# EAGLE design 10+12-Bit RasPi-ADC_HAT v21 (EAGLE 8.2.2)
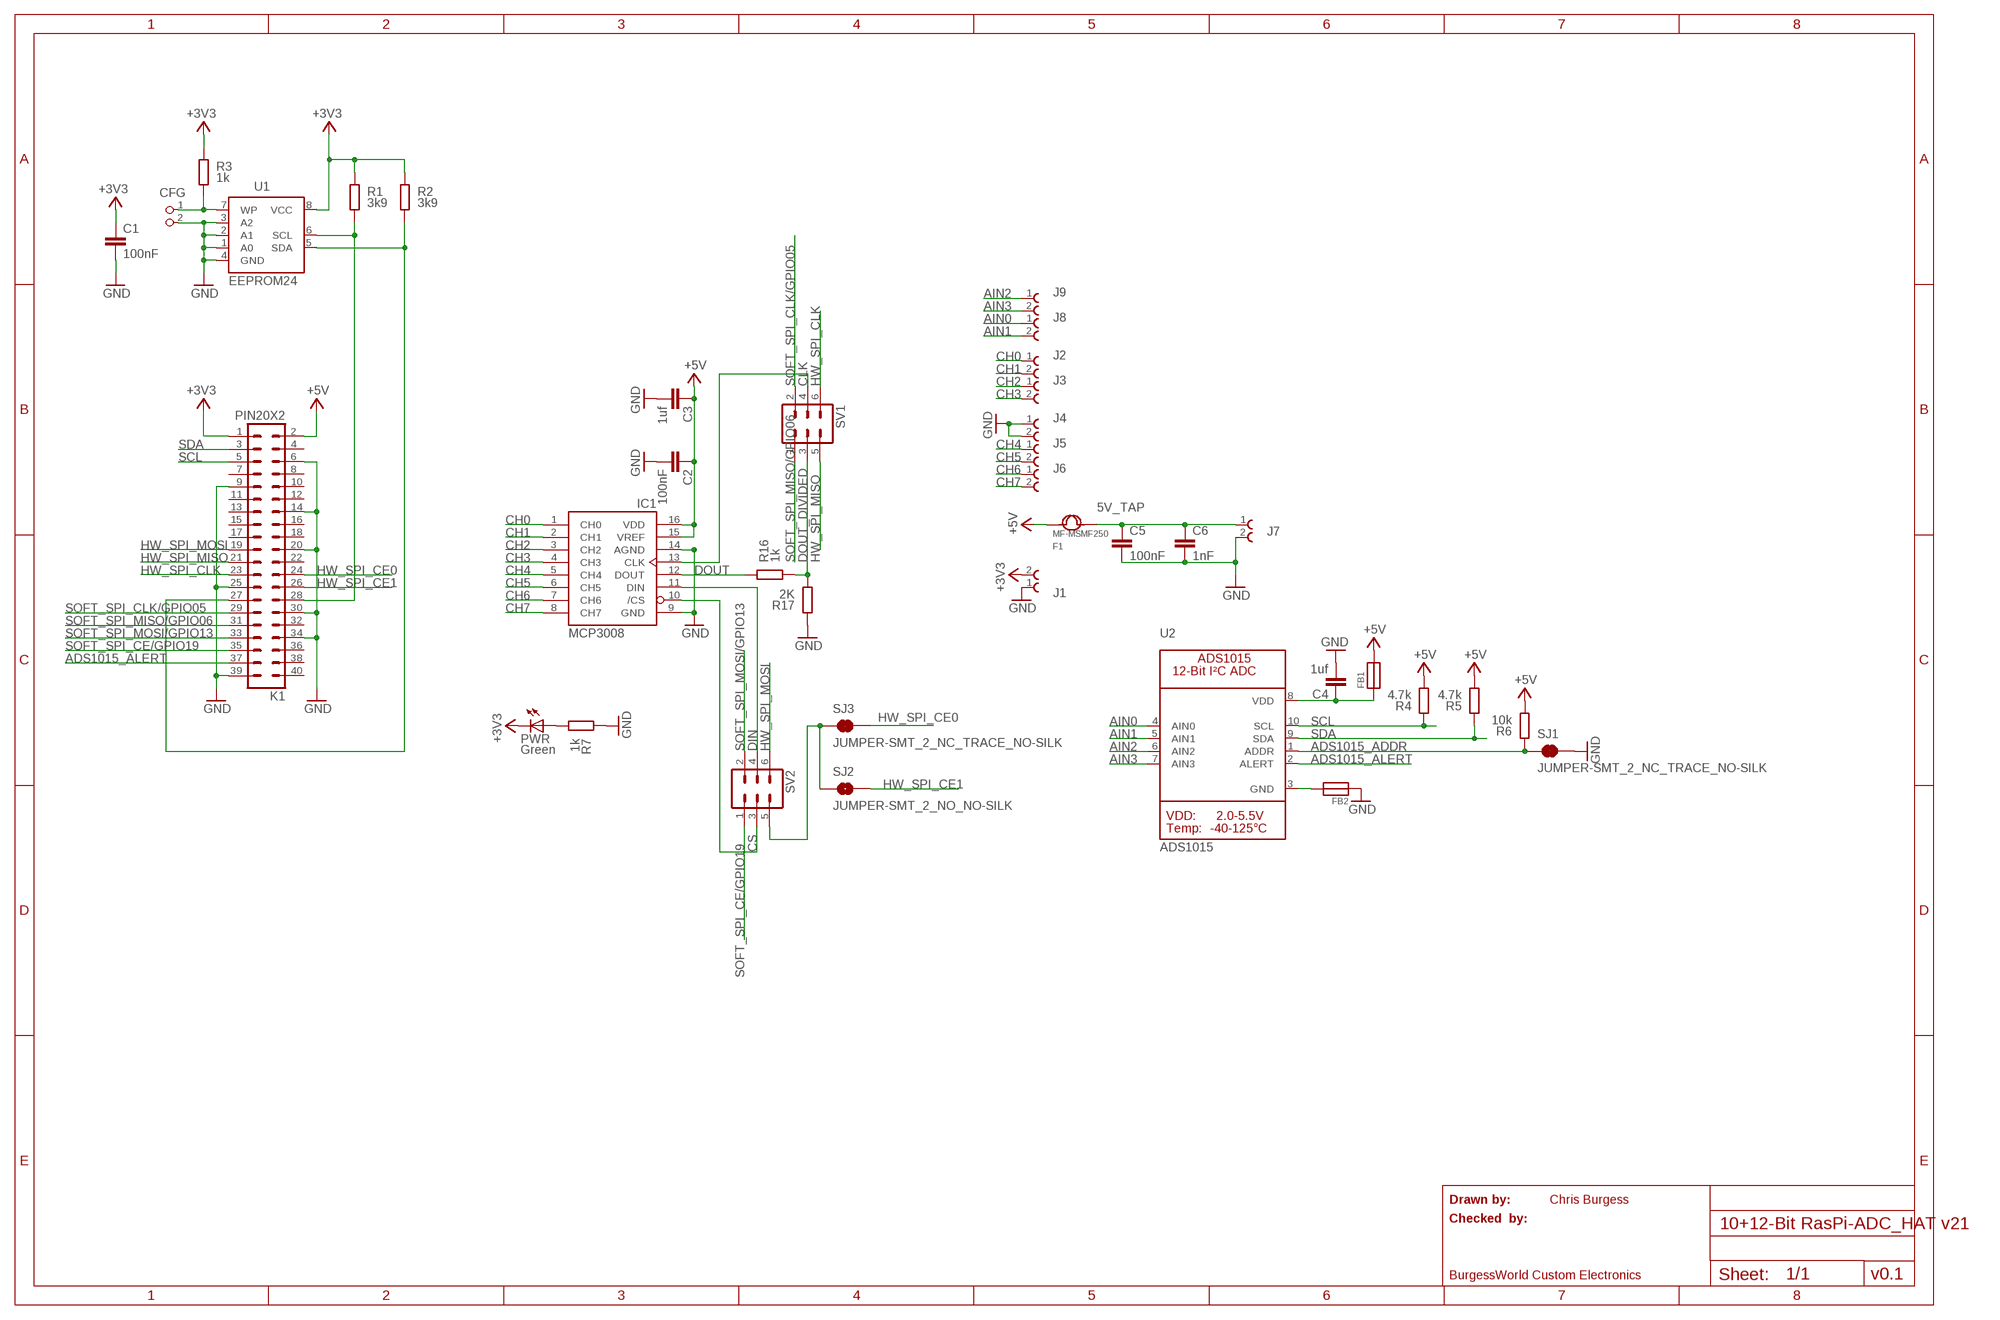
[diagram p0: schematic, sheet 1]

## Parts
C1  100nF  C-EUC0805K  [C0805K]
C2  100nF  C-EUC0805K  [C0805K]
C3  1uf  C-EUC0805K  [C0805K]
C4  1uf  C-EUC0805K  [C0805K]
C5  100nF  C-EUC0805K  [C0805K]
C6  1nF  C-EUC0805K  [C0805K]
CFG  PIN2_100  [PIN_W_2]
F1  MF-MSMF250  SMD-PPTC-USE-PPTC-0.50A-15V-0.15OHM(1812)  [F1812]
FB1  FERRITE0805  [0805]
FB2  FERRITE0805  [0805]
IC1  MCP3008  [DIL16]
J1  691214110002  [691214110002]
J2  691214110002  [691214110002]
J3  691214110002  [691214110002]
J4  691214110002  [691214110002]
J5  691214110002  [691214110002]
J6  691214110002  [691214110002]
J7  691214110002  [691214110002]
J8  691214110002  [691214110002]
J9  691214110002  [691214110002]
K1  PIN20X2  [PIN_20X2]
PWR  Green  LEDCHIPLED_0805  [CHIPLED_0805]
R1  3k9  R-EU_M0805  [M0805]
R2  3k9  R-EU_M0805  [M0805]
R3  1k  R-EU_M0805  [M0805]
R4  4.7k  R-EU_M0805  [M0805]
R5  4.7k  R-EU_M0805  [M0805]
R6  10k  R-EU_M0805  [M0805]
R7  1k  R-EU_M0805  [M0805]
R16  1k  R-EU_M0805  [M0805]
R17  2K  R-EU_M0805  [M0805]
SJ1  JUMPER-SMT_2_NC_TRACE_NO-SILK  [SMT-JUMPER_2_NC_TRACE_NO-SILK]
SJ2  JUMPER-SMT_2_NO_NO-SILK  [SMT-JUMPER_2_NO_NO-SILK]
SJ3  JUMPER-SMT_2_NC_TRACE_NO-SILK  [SMT-JUMPER_2_NC_TRACE_NO-SILK]
SV1  MA03-2  [MA03-2]
SV2  MA03-2  [MA03-2]
U1  EEPROM24  [SOIC8]
U2  ADS1015  ADC_ADS1015  [MSOP10]

## Nets
5V_TAP: C5.1 C6.1 F1.2 J7.1
+3V3: C1.1 J1.2 K1.1 PWR.C R1.2 R2.2 R3.2 U1.8(VCC)
+5V: C2.1 C3.1 F1.1 FB1.2 IC1.15(VREF) IC1.16(VDD) K1.2 R4.1 R5.1 R6.1
ADS1015_ADDR: R6.2 SJ1.1 U2.1(ADDR)
ADS1015_ALERT: K1.37 U2.2(ALERT)
ADS1015_FB: FB2.2 U2.3(GND)
ADS1015_VDD: C4.1 FB1.1 U2.8(VDD)
AIN0: J8.1 U2.4(AIN0)
AIN1: J8.2 U2.5(AIN1)
AIN2: J9.1 U2.6(AIN2)
AIN3: J9.2 U2.7(AIN3)
CH0: IC1.1(CH0) J2.1
CH1: IC1.2(CH1) J2.2
CH2: IC1.3(CH2) J3.1
CH3: IC1.4(CH3) J3.2
CH4: IC1.5(CH4) J5.1
CH5: IC1.6(CH5) J5.2
CH6: IC1.7(CH6) J6.1
CH7: IC1.8(CH7) J6.2
CLK: IC1.13(CLK) SV1.4
CS: IC1.10(/CS) SV2.3
DIN: IC1.11(DIN) SV2.4
DOUT: IC1.12(DOUT) R16.2
DOUT_DIVIDED: R16.1 R17.1 SV1.3
EEPROM_PROG: CFG.1 R3.1 U1.7(WP)
GND: C1.2 C2.2 C3.2 C4.2 C5.2 C6.2 CFG.2 FB2.1 IC1.9(GND) IC1.14(AGND) J1.1 J4.1 J4.2 J7.2 K1.6 K1.9 K1.14 K1.20 K1.25 K1.30 K1.34 K1.39 R7.2 R17.2 SJ1.2 U1.1(A0) U1.2(A1) U1.3(A2) U1.4(GND)
HW_SPI_CE: SJ2.1 SJ3.1 SV2.5
HW_SPI_CE0: K1.24 SJ3.2
HW_SPI_CE1: K1.26 SJ2.2
HW_SPI_CLK: K1.23 SV1.6
HW_SPI_MISO: K1.21 SV1.5
HW_SPI_MOSI: K1.19 SV2.6
ID_SC_27: K1.27 R2.1 U1.5(SDA)
ID_SC_28: K1.28 R1.1 U1.6(SCL)
N$1: PWR.A R7.1
SCL: K1.5 R4.2 U2.10(SCL)
SDA: K1.3 R5.2 U2.9(SDA)
SOFT_SPI_CE/GPIO19: K1.35 SV2.1
SOFT_SPI_CLK/GPIO05: K1.29 SV1.2
SOFT_SPI_MISO/GPIO06: K1.31 SV1.1
SOFT_SPI_MOSI/GPIO13: K1.33 SV2.2
Unconnected: K1.4 K1.7 K1.8 K1.10 K1.11 K1.12 K1.13 K1.15 K1.16 K1.17 K1.18 K1.22 K1.32 K1.36 K1.38 K1.40

## Notes on the sheet
- Drawn by: | Chris Burgess
- Checked  by:
- BurgessWorld Custom Electronics | v0.1

## Library data of the parts
C1-C6 = resistor:C-EU: CAPACITOR, European symbol; DIELECTRIC: X7R
CFG = FLYFISH:PIN2
F1 = Seeed-Fuse-2016:SMD-PPTC-USE-PPTC-0.50A-15V-0.15OHM(1812): 307010040; MPN: MF-MSMF050-2; VALUE: MF-MSMF050-2
FB1 FB2 = Adafruit_ADS1015_12Bit_I2C_ADC:FERRITE: Ferrite Bead 0603 MMZ1608B121C - 120 Ohm, 600mA Ferrite Chip - Digikey: 445-2164-1-ND BK1608HW121-T - 120 Ohm, 600mA Ferrite Chip - Digikey: 587-1876-2-ND 0805 HZ0805B272R-10 - 2.7K Ohm @ 100MHz, 200mA 0.8 Ohm DC Resistance - Digikey: 240-2504-1-ND (see also Murata BLM21BD272SN1L)
IC1 = adafruit:MCP3008
J1-J9 = Wurth_Elektronik_Electromechanic_Terminal_Blocks_Connectors_rev16e:691214110002: WR-TBL Serie 2141 - 3.5mm Horizontal Entry Modular with Rising Cage Clamp - 1.3 mm2 Wires, 2 Pins=>Code : Con_TBL_Screw_RisingClamp_3.50_691214110002 <http://katalog.we-online.de/media/images/eican/Con_TBL_Screw_RisingClamp_3.50_6912141100xx_pf2.jpg> Details see: http://katalog.we-online.de/en/em/TBL_3_50_2141_HORIZONTAL_ENTRY_MODULAR_69121411000X Created 2014-06-18, Karrer Zheng 2014 (C) Würth Elektronik
K1 = FLYFISH:PIN20X2
PWR = adafruit:LED: LED OSRAM: - CHIPLED LG R971, LG N971, LY N971, LG Q971, LY Q971, LO R971, LY R971 LH N974, LH R974 LS Q976, LO Q976, LY Q976 LO Q996 - Hyper CHIPLED LW Q18S LB Q993, LB Q99A, LB R99A - SideLED LS A670, LO A670, LY A670, LG A670, LP A670 LB A673, LV A673, LT A673, LW A673 LH A674 LY A675 LS A676, LA A676, LO A676, LY A676, LW A676 LS A679, LY A679, LG A679 - Hyper Micro SIDELED® LS Y876, LA Y876, LO Y876, LY Y876 LT Y87S - SmartLED LW L88C, LW L88S LB L89C, LB L89S, LG L890 LS L89K, LO L89K, LY L89K LS L896, LA L896, LO L896, LY L896 - TOPLED LS T670, LO T670, LY T670, LG T670, LP T670 LSG T670, LSP T670, LSY T670, LOP T670, LYG T670 LG T671, LOG T671, LSG T671 LB T673, LV T673, LT T673, LW T673 LH T674 LS T676, LA T676, LO T676, LY T676, LB T676, LH T676, LSB T676, LW T676 LB T67C, LV T67C, LT T67C, LS T67K, LO T67K, LY T67K, LW E67C LS E67B, LA E67B, LO E67B, LY E67B, LB E67C, LV E67C, LT E67C LW T67C LS T679, LY T679, LG T679 LS T770, LO T770, LY T770, LG T770, LP T770 LB T773, LV T773, LT T773, LW T773 LH T774 LS E675, LA E675, LY E675, LS T675 LS T776, LA T776, LO T776, LY T776, LB T776 LHGB T686 LT T68C, LB T68C - Hyper Mini TOPLED® LB M676 - Mini TOPLED Santana® LG M470 LS M47K, LO M47K, LY M47K Source: http://www.osram.convergy.de/
R1-R7 R16 R17 = resistor:R-EU_: RESISTOR, European symbol; TOLERANCE: 5%
SJ1 SJ3 = SparkFun-Jumpers:JUMPER-SMT_2_NC_TRACE: Normally closed trace jumper This jumper has a trace between two pads so it's normally closed (NC). Use a razor knife to open the connection. For best results follow the IPC guidelines for cutting traces: Cutout at least 0.063 mm (0.005 in). Remove all loose material to clean up the cut area. Seal the cut with an approved epoxy. Reapply solder to reclose the connection.
SJ2 = SparkFun-Jumpers:JUMPER-SMT_2_NO: Normally open jumper This jumper has two pads in close proximity to each other. Apply solder to close the connection. Round pads are easier to solder for beginners, but are a lot larger. SparkFun Product that uses the round pads: SparkFun EL Sequencer <https://www.sparkfun.com/products/12781>
SV1 SV2 = my-custom-lib:MA03-2: PIN HEADER; OC_FARNELL: unknown; OC_NEWARK: unknown
U1 = FLYFISH:EEPROM24
U2 = Adafruit_ADS1015_12Bit_I2C_ADC:ADC_ADS1015: ADS1015 - 12-bit 4-Channel I2C ADC with Internal PGA VDD: 2.0-5.5V Sampling Rate: 3.3ksps Gain Settings: 2/3, 1, 2, 4, 8, 16 I2C Address: ADDR low = 1001000x, ADDR high = 1001001x Internal Comparator The ADS1015 includes an internal comparator that can be set to output a high-level on ALERT when the conversion results exceeeds a pre-defined upper level, and will deassert itself when the level falls below a pre-defined lower threshold level. It can also be set to windowed mode where the ALERT pin will be asserted if the data exceeds the upper threshold or falls below the lower threshold.

## Board
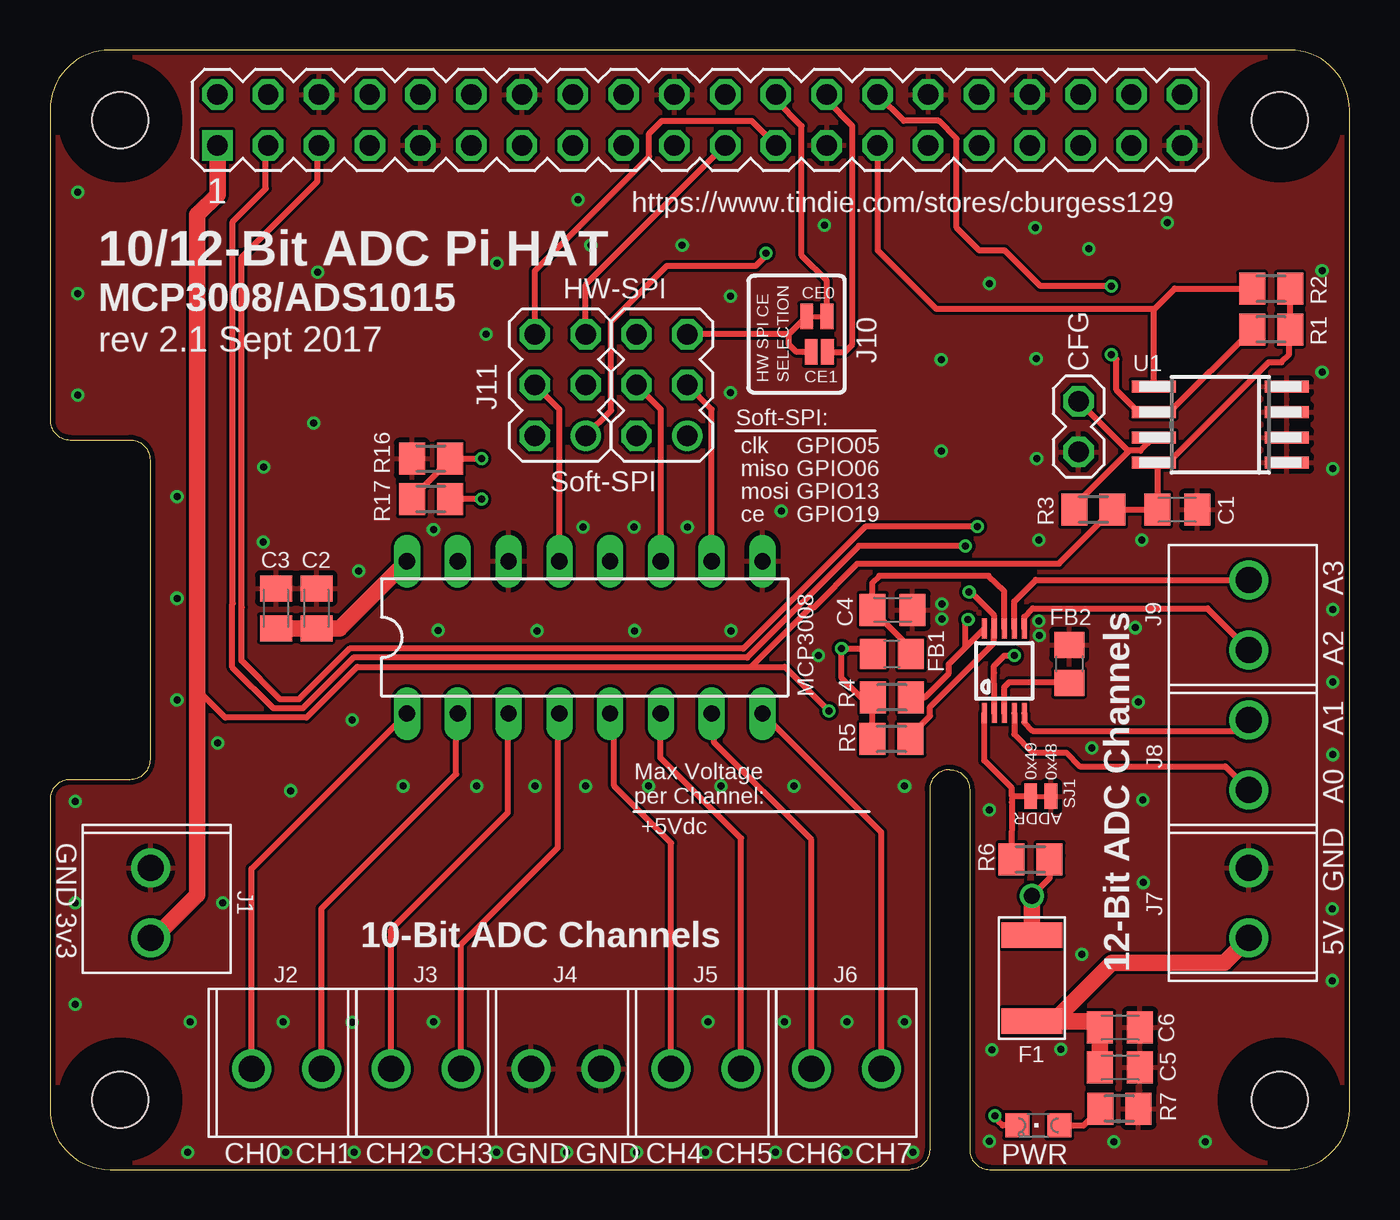
[diagram p1: board, top side]
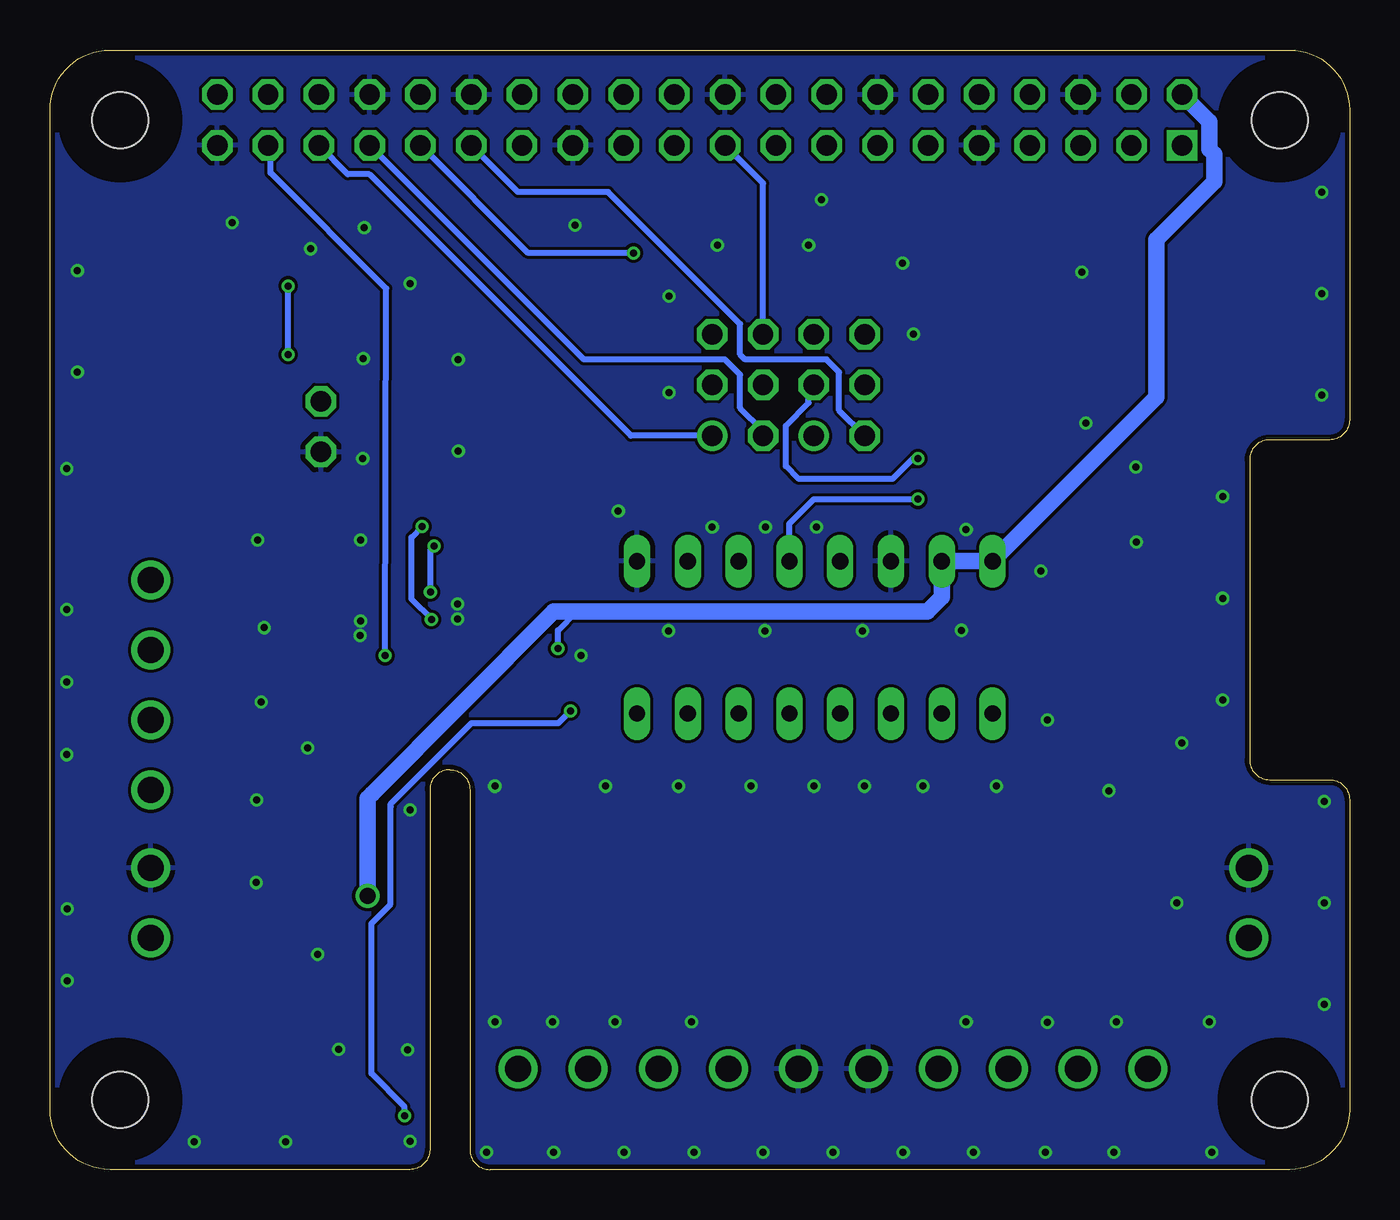
[diagram p2: board, bottom side, seen from below]

Size 65 x 56 mm. Coordinates in mm from the lower left corner, seen from the top.
Outline: 0,3 arc90 3,0 43,0 arc90 44,1 44,19 arc-90 45,20 arc-90 46,19 46,1 arc90 47,0 62,0 arc90 65,3 65,53 arc90 62,56 3,56 arc90 0,53 0,37.5 arc90 1,36.5 4,36.5 arc-90 5,35.5 5,20.5 arc-90 4,19.5 1,19.5 arc90 0,18.5 0,3
Copper layers (1*16): Top 0.035mm / dielectric 1.5mm / Bottom 0.035mm
Design rules "ITEADstudio_DRC": minimum track width 6mil, minimum drill 12mil, track to track 6mil, track to pad 6mil, pad to pad 6mil, via to via 6mil, smd to smd 0mil, copper to edge 10mil, drill to drill 10mil, minimum pad ring 10mil, minimum via ring 6mil, stop-mask expansion 2mil, vias tented up to drill 100mil, thermal gap 10mil
Holes 2.8 mm at 3.5,3.5 3.5,52.5 61.5,52.5 61.5,3.5
tRestrict: area 1.9,51 to 5,54; area 60,51 to 63,54; area 60,1.9 to 63,5; area 1.9,1.9 to 5,5
bRestrict: area 1.9,1.9 to 5,5; area 1.9,51 to 5,54; area 60,1.9 to 63,5; area 60,51 to 63,54

### Footprints (pad centres in the part's own frame; a part is rotated, then mirrored left to right if it is on the bottom)
C0805K = smd 1.3 x 1.6: 1 -1,0; 2 1,0
PIN_W_2 = drill 1.016 octagon: 1 0,0; 2 0,-2.54
F1812 = smd 1.27 x 3.048: 1 -2.159,0; 2 2.159,0
0805 = smd 1.3 x 1.5: 1 -0.95,0; 2 0.95,0
DIL16 = drill 0.813 long: 1 -8.89,-3.81; 2 -6.35,-3.81; 3 -3.81,-3.81; 4 -1.27,-3.81; 5 1.27,-3.81; 6 3.81,-3.81; 7 6.35,-3.81; 8 8.89,-3.81; 9 8.89,3.81; 10 6.35,3.81; 11 3.81,3.81; 12 1.27,3.81; 13 -1.27,3.81; 14 -3.81,3.81; 15 -6.35,3.81; 16 -8.89,3.81
691214110002 = drill 1.3: 1 -1.75,0; 2 1.75,0
PIN_20X2 = drill 1.016 square: 1 -24.13,-1.27 | drill 1.016 octagon: 2 -24.13,1.27; 3 -21.59,-1.27; 4 -21.59,1.27; 5 -19.05,-1.27; 6 -19.05,1.27; 7 -16.51,-1.27; 8 -16.51,1.27; 9 -13.97,-1.27; 10 -13.97,1.27; 11 -11.43,-1.27; 12 -11.43,1.27; 13 -8.89,-1.27; 14 -8.89,1.27; 15 -6.35,-1.27; 16 -6.35,1.27; 17 -3.81,-1.27; 18 -3.81,1.27; 19 -1.27,-1.27; 20 -1.27,1.27; 21 1.27,-1.27; 22 1.27,1.27; 23 3.81,-1.27; 24 3.81,1.27; 25 6.35,-1.27; 26 6.35,1.27; 27 8.89,-1.27; 28 8.89,1.27; 29 11.43,-1.27; 30 11.43,1.27; 31 13.97,-1.27; 32 13.97,1.27; 33 16.51,-1.27; 34 16.51,1.27; 35 19.05,-1.27; 36 19.05,1.27; 37 21.59,-1.27; 38 21.59,1.27; 39 24.13,-1.27; 40 24.13,1.27
CHIPLED_0805 = smd 1.2 x 1.2: A 0,-1.05; C 0,1.05
M0805 = smd 1.3 x 1.6: 1 -0.95,0; 2 0.95,0
SMT-JUMPER_2_NC_TRACE_NO-SILK = smd 0.635 x 1.27: 1 -0.508,0; 2 0.508,0
SMT-JUMPER_2_NO_NO-SILK = smd 0.635 x 1.27: 1 -0.406,0; 2 0.406,0
MA03-2 = drill 1.016: 1 -2.54,-1.27 | drill 1.016 octagon: 2 -2.54,1.27; 3 0,-1.27; 4 0,1.27; 5 2.54,-1.27; 6 2.54,1.27
SOIC8 = smd 0.6 x 2.2: 1 -1.905,-3.33; 2 -0.635,-3.33; 3 0.635,-3.33; 4 1.905,-3.33; 5 1.905,3.33; 6 0.635,3.33; 7 -0.635,3.33; 8 -1.905,3.33
MSOP10 = smd 0.25 x 1: 1 -1,-2.113; 2 -0.5,-2.113; 3 0,-2.113; 4 0.5,-2.113; 5 1,-2.113; 6 1,2.113; 7 0.5,2.113; 8 0,2.113; 9 -0.5,2.113; 10 -1,2.113

### Placement (x,y rotation side)
C1  56.38,33.01 0 top
C2  13.34,28.07 90 top
C3  11.3,28.07 90 top
C4  42.14,27.99 0 top
C5  53.52,7.11 0 top
C6  53.52,5.11 0 top
CFG  51.45,38.43 0 top
F1  49.12,9.58 270 top
FB1  42.11,25.78 180 top
FB2  50.98,25.3 270 top
IC1  26.75,26.62 0 top
J1  5.03,13.34 270 top
J2  11.84,5.03 0 top
J3  18.82,5.03 0 top
J4  25.81,5.03 0 top
J5  32.82,5.03 0 top
J6  39.83,5.03 0 top
J7  59.97,13.34 90 top
J8  59.97,20.73 90 top
J9  59.97,27.74 90 top
K1  32.5,52.5 0 top
PWR  49.43,2.21 90 top
R1  61.08,42.02 0 top
R2  61.08,44.05 0 top
R3  52.19,33.01 0 top
R4  42.11,23.62 0 top
R5  42.09,21.54 0 top
R6  49.05,15.52 180 top
R7  53.49,3.05 0 top
R16  19.05,33.53 0 top
R17  19.05,35.56 180 top
SJ1  49.56,18.67 0 top
SJ2  38.48,40.89 0 top
SJ3  38.35,42.67 0 top
SV1  25.53,39.24 90 top
SV2  30.61,39.24 90 top
U1  58.53,37.26 90 top
U2  47.73,24.94 0 top

### Tracks (layer width: path | path; a pad name or v marks a point on that pad's centre or on a via)
5V_TAP
  Top 0.813: J7.1 58.73,10.34 53.11,10.34 50.16,7.39 F1.2 52.21,7.42 C5.1 C6.1
+3V3  (via drill 0.35)
  Top 0.305: 53.17,33.01 R3.2 | 53.17,33.01 C1.1 55.38,35.18 U1.8 55.93,35.35 60.96,40.39 61.59,40.39 61.98,40.77 61.98,41.97 R1.2 R2.2 | 7.37,24 8.76,22.61 12.83,22.61 15.37,25.15 35.07,25.15 | 8.38,51.12 K1.1 | J1.2 5.21,11.59 | 53.17,33.01 50.47,30.3 40.39,30.3 38.18,28.09 38.01,28.09 35.07,25.15 | PWR.C 47.65,2.21 47.42,2.44 47.42,2.54 v47.27,2.69 | 35.07,25.15 36.75,25.15 v38.96,22.94
  Top 0.813: 8.38,51.12 8.38,48.77 7.37,47.75 7.37,24 7.37,13.74 5.21,11.59
  Bottom 0.305: K1.1 8.37,51.07 | v47.27,2.69 47.27,3.15 48.92,4.8 48.92,12.31 47.97,13.27 47.97,14.02 47.98,18.14 47.95,18.16 47.95,18.29 43.92,22.33 39.57,22.33 v38.96,22.94 38.91,22.99
+5V  (via drill 0.35, 0.8)
  Top 0.305: IC1.16 | 13.35,27.05 C2.1 | R5.1 41.14,23.6 R4.1 40.56,23.62 39.6,24.59 v39.6,26.06 40.88,26.06 FB1.2 | 50.49,15.71 R6.1 50,14.56 v49.12,13.69
  Top 0.813: IC1.16 14.48,27.05 13.35,27.05 | C2.1 C3.1 | F1.1 v49.12,13.69
  Bottom 0.305: 17.96,30.43 17.91,30.38 IC1.16 17.8,30.48 | v39.6,26.06 39.6,26.97 38.65,27.91
  Bottom 0.813: 17.96,30.43 IC1.15 20.4,28.63 21.11,27.91 38.65,27.91 39.8,27.91 48.9,18.8 49.12,18.57 v49.12,13.69 | 17.8,30.48 9.65,38.63 9.65,46.51 6.76,49.4 6.76,50.8 7.01,51.05 7.01,52.41 K1.2
ADS1015_ADDR
  Top 0.305: 48.11,18.69 48.11,19.07 46.73,20.46 U2.1 | 48.11,18.69 48.11,18.38 R6.2 | SJ1.1 48.26,18.67 48.11,18.69
ADS1015_ALERT  (via drill 0.35)
  Top 0.305: U2.2 47.23,23.81 47.22,24.84 47.22,25.2 47.73,25.7 v48.23,25.7
  Bottom 0.305: v48.23,25.7 48.18,44.07 53.98,49.86 53.98,51.12 K1.37
ADS1015_FB
  Top 0.305: U2.3 47.73,24.13 47.98,24.38 51.55,24.38 FB2.2
ADS1015_VDD
  Top 0.305: U2.8 47.73,28.93 46.94,29.69 41.48,29.69 41.12,29.34 C4.1 43.06,26.06 FB1.1
AIN0
  Top 0.305: U2.4 48.23,21.78 49.15,20.85 50.83,20.85 51.51,20.17 58.78,20.17 J8.1
AIN1
  Top 0.305: U2.5 48.73,22.37 49.15,21.95 59.44,21.95 J8.2
AIN2
  Top 0.305: U2.6 48.73,27.64 49.15,28.07 57.89,28.07 J9.1
AIN3
  Top 0.305: U2.7 48.23,28.41 49.3,29.49 J9.2
CH0
  Top 0.305: J2.1 10.09,15.04 IC1.1
CH1
  Top 0.152: 20.32,22.73 IC1.2
  Top 0.305: J2.2 13.59,13.05 20.32,19.79 20.32,22.73
CH2
  Top 0.152: 23.34,22.38 23.34,22.4
  Top 0.305: J3.1 17.07,12.02 22.91,17.86 22.91,21.95 23.34,22.38 | 23.34,22.4 IC1.3
CH3
  Top 0.305: J3.2 20.57,11.28 25.4,16.1 25.4,22.73 IC1.4
CH4
  Top 0.305: IC1.5 28.22,22.61 28.22,19.18 31.07,16.33 J5.1
CH5
  Top 0.305: J5.2 34.57,16.56 30.53,20.6 30.53,22.79 IC1.6
CH6
  Top 0.305: J6.1 38.08,16.51 33.22,21.36 33.22,22.68 IC1.7
CH7
  Top 0.305: J6.2 41.58,16.87 IC1.8
CLK
  Top 0.305: IC1.13 25.48,38.02 SV1.4
CS
  Top 0.305: IC1.10 33.1,38.02 SV2.3
DIN
  Top 0.305: IC1.11 30.56,38.02 SV2.4
DOUT  (via drill 0.35)
  Top 0.305: v21.59,33.53 R16.2
  Bottom 0.305: IC1.12 28.02,32.31 26.8,33.53 v21.59,33.53
DOUT_DIVIDED  (via drill 0.35)
  Top 0.305: v21.59,35.56 R17.1 20.32,35.24 20.32,35.05 20.19,34.92 19.43,34.92 18.1,33.59 R16.1
  Bottom 0.305: v21.59,35.56 21.84,35.56 22.86,34.54 27.56,34.54 28.19,35.18 28.19,37.21 27.05,38.35 27.05,38.99 SV1.3
EEPROM_PROG
  Top 0.305: 53.98,35.96 54.54,35.96 U1.7 | R3.1 51.25,33.02 51.25,33.23 53.98,35.96 | 53.98,35.96 53.92,35.96 CFG.1
GND  (via drill 0.35)
  other vias: 11.79,0.86 15.21,0.86 22.33,0.86 25.83,0.86 32.79,0.86 36.3,0.86 39.8,0.86 1.27,13.34 1.27,8.26 1.27,18.41 46.99,1.42 53.21,1.4 46.99,17.98 42.75,7.39 39.85,7.39 64.16,20.75 64.14,13.03 64.14,9.45 64.16,24.38 64.16,28.02 64.16,35.05 63.63,39.88 63.63,44.96 55.88,47.37 6.35,23.5 6.35,28.57 6.35,33.66 1.4,38.73 1.4,43.81 1.4,48.9 10.69,35.13 10.67,31.39 8.38,21.34 15.11,22.48 19.41,26.97 24.36,26.95 29.24,26.95 34.06,26.95 36.58,32.94 13.39,44.88 19.18,32 29.21,32.13 31.88,32.13 26.67,32.13 8.64,13.34 32.92,7.39 36.73,7.39 17.65,19.18 21.34,19.18 24.26,19.18 22.35,45.34 21.82,41.78 27.05,46.23 26.42,48.51 31.62,46.23 34.04,38.86 38.73,47.24 44.58,40.51 49.28,47.12 46.99,44.32 44.58,35.94 54.61,31.5 34.04,43.69 18.82,0.86 29.34,0.86 19.18,7.39 15.11,7.37 11.66,7.39 7.01,7.39 6.88,0.86 43.15,0.86 26.8,19.18 12.04,18.95 57.78,1.4 29.95,19.18 33.55,19.18 37.21,19.18 42.75,19.18 15.44,29.95 13.18,37.34 51.97,46.05 49.33,40.56 49.35,35.56 49.45,31.5 54.28,27.1 54.43,23.39 44.6,27.53 49.48,26.72 49.45,27.43 44.6,28.3 54.66,18.49 54.69,14.35 52.12,21.08 38.43,25.7 47.12,5.99 50.57,6.02 51.61,10.77
  pour Bottom: 0,3 arc90 3,0 43,0 arc90 44,1 44,19 arc-90 45,20 arc-90 46,19 46,1 arc90 47,0 62,0 arc90 65,3 65,53 arc90 62,56 3,56 arc90 0,53 0,37.5 arc90 1,36.5 4,36.5 arc-90 5,35.5 5,20.5 arc-90 4,19.5 1,19.5 arc90 0,18.5
  pour Top: 0,3 arc90 3,0 43,0 arc90 44,1 44,19 arc-90 45,20 arc-90 46,19 46,1 arc90 47,0 62,0 arc90 65,3 65,53 arc90 62,56 3,56 arc90 0,53 0,37.5 arc90 1,36.5 4,36.5 arc-90 5,35.5 5,20.5 arc-90 4,19.5 1,19.5 arc90 0,18.5
HW_SPI_CE
  Top 0.305: 36.96,41.78 SV2.5 | SJ2.1 37.34,40.89 36.96,41.27 36.96,41.78 | SJ3.1 36.96,41.78
HW_SPI_CE0
  Top 0.305: K1.24 36.31,53.48 37.59,52.2 37.59,45.72 38.86,44.45 SJ3.2
HW_SPI_CE1
  Top 0.305: K1.26 38.85,53.48 40.13,52.2 40.13,41.27 39.75,40.89 SJ2.2
HW_SPI_CLK
  Top 0.305: SV1.6 24.26,44.96 29.97,50.67 29.97,51.82 30.61,52.45 35.09,52.45 K1.23
HW_SPI_MISO
  Top 0.305: SV1.5 26.8,44.26 K1.21
HW_SPI_MOSI
  Bottom 0.305: SV2.6 29.34,49.34 K1.19
ID_SC_27
  Top 0.305: U1.5 55.2,43.01 | K1.27 41.39,45.99 44.32,43.05 55.16,43.05 55.2,43.01 | 55.2,43.01 56.26,44.07 60.11,44.07 R2.1
ID_SC_28  (via drill 0.35)
  Top 0.305: R1.1 56,37.9 U1.6 54.43,37.9 53.34,38.99 53.34,40.51 v53.09,40.77 | v53.09,44.2 49.53,44.2 47.75,45.97 46.48,45.97 45.34,47.12 45.34,51.56 44.45,52.45 42.71,52.45 K1.28
  Bottom 0.305: v53.09,40.77 v53.09,44.2
N$1
  Top 0.305: PWR.A 51.7,2.21 R7.1
SCL  (via drill 0.35)
  Top 0.305: R4.2 43.76,23.62 44.96,24.82 44.96,25.29 45.79,26.12 | U2.10 45.99,26.32 45.79,26.12 | 45.79,26.12 45.8,27.46 45.77,27.46 v45.92,27.51 | K1.5 13.39,51.17 13.39,49.43 9.6,45.64 9.6,28.12 9.58,28.1 9.58,25.45 11.51,23.52 12.45,23.52 14.99,26.06 34.69,26.06 40.78,32.16 v46.38,32.16
  Bottom 0.305: v45.92,27.51 45.87,27.51 46.91,28.55 46.91,31.62 v46.38,32.16
SDA  (via drill 0.35)
  Top 0.305: R5.2 43.04,21.72 44.02,22.7 44.02,23.14 47.22,26.34 47.22,27.05 U2.9 47.23,27.7 46.13,28.8 46.05,28.8 v45.97,28.88 | v45.8,31.19 40.46,31.19 34.87,25.6 15.18,25.6 12.64,23.06 11.18,23.06 9.12,25.12 9.12,28.29 9.14,28.31 9.14,47.42 10.79,49.07 10.79,51.12 K1.3
  Bottom 0.305: v45.97,28.88 45.97,30.99 45.8,31.17 v45.8,31.19
SOFT_SPI_CE/GPIO19
  Bottom 0.305: SV2.1 35.94,36.7 49.02,49.78 50.1,49.78 K1.35
SOFT_SPI_CLK/GPIO05
  Bottom 0.305: SV1.2 25.53,37.97 25.53,39.88 26.16,40.51 30.23,40.51 30.48,40.77 30.48,42.29 37.08,48.9 41.59,48.9 K1.29
SOFT_SPI_MISO/GPIO06  (via drill 0.35)
  Top 0.305: SV1.1 28.07,37.97 28.07,42.42 30.86,45.21 35.31,45.21 35.94,45.85 v35.81,45.85
  Bottom 0.305: v35.81,45.85 41.09,45.85 K1.31
SOFT_SPI_MOSI/GPIO13
  Bottom 0.305: SV2.2 29.34,36.96 30.48,38.1 30.48,39.75 31.24,40.51 38.29,40.51 K1.33

### Text on the board
tPlace: https://www.tindie.com/stores/cburgess129 | 10/12-Bit ADC Pi HAT | HW-SPI | MCP3008/ADS1015 | rev 2.1 Sept 2017 | HW SPI CE | SELECTION | Soft-SPI: | clk | GPIO05 | miso | GPIO06 | Soft-SPI | mosi | GPIO13 | ce | GPIO19 | 0x49 | 0x48 | Max Voltage / per Channel: | ADDR | +5Vdc | 10-Bit ADC Channels | 12-Bit ADC Channels
tNames: CE0 | J10 | CE1 | J11 | A3 | A2 | A1 | A0 | GND | GND | 3v3 | 5V | CH0 | CH1 | CH2 | CH3 | GND | GND | CH4 | CH5 | CH6 | CH7